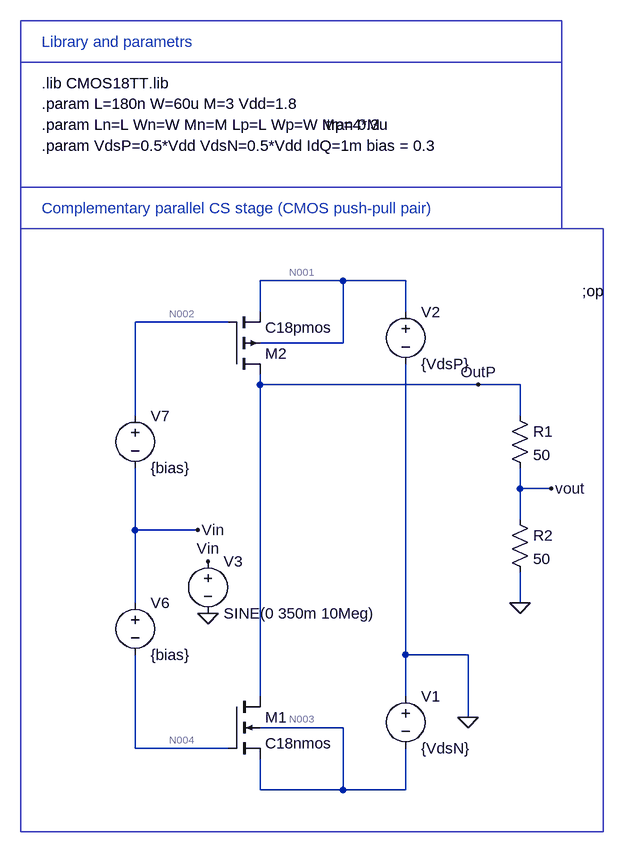
[diagram p0: schematic CompParallel.asc]
CompParallel.asc, the LTspice schematic file:
Version 4
SHEET 1 1812 980
WIRE 864 16 736 16
WIRE 960 16 864 16
WIRE 736 64 736 16
WIRE 960 64 960 16
WIRE 688 80 544 80
WIRE 864 112 864 16
WIRE 864 112 736 112
WIRE 736 176 736 160
WIRE 1072 176 736 176
WIRE 1136 176 1072 176
WIRE 544 224 544 80
WIRE 1136 224 1136 176
WIRE 1136 336 1136 304
WIRE 1184 336 1136 336
WIRE 1136 384 1136 336
WIRE 544 400 544 304
WIRE 640 400 544 400
WIRE 544 512 544 400
WIRE 1136 512 1136 464
WIRE 960 592 960 144
WIRE 1056 592 960 592
WIRE 736 656 736 176
WIRE 960 656 960 592
WIRE 1056 688 1056 592
WIRE 864 704 736 704
WIRE 544 736 544 592
WIRE 688 736 544 736
WIRE 736 800 736 752
WIRE 864 800 864 704
WIRE 864 800 736 800
WIRE 960 800 960 736
WIRE 960 800 864 800
FLAG 1072 176 OutP
FLAG 1056 688 0
FLAG 656 528 0
FLAG 656 448 Vin
FLAG 640 400 Vin
FLAG 1136 512 0
FLAG 1184 336 vout
DATAFLAG 640 80 ""
DATAFLAG 640 736 ""
SYMBOL nmos4 688 656 R0
SYMATTR InstName M1
SYMATTR Value C18nmos
SYMATTR Value2 l={Ln} w={Wn} m={Mn}
SYMBOL pmos4 688 160 M180
SYMATTR InstName M2
SYMATTR Value2 l={Lp} w={Wp} m={Mp}
SYMATTR Value C18pmos
SYMBOL voltage 960 640 R0
SYMATTR InstName V1
SYMATTR Value {VdsN}
SYMBOL voltage 960 48 R0
WINDOW 123 0 0 Left 0
WINDOW 39 0 0 Left 0
SYMATTR InstName V2
SYMATTR Value {VdsP}
SYMBOL voltage 656 432 R0
WINDOW 123 0 0 Left 0
WINDOW 39 0 0 Left 0
SYMATTR InstName V3
SYMATTR Value SINE(0 350m 10Meg)
SYMBOL voltage 544 496 R0
SYMATTR InstName V6
SYMATTR Value {bias}
SYMBOL voltage 544 208 R0
WINDOW 123 0 0 Left 0
WINDOW 39 0 0 Left 0
SYMATTR InstName V7
SYMATTR Value {bias}
SYMBOL res 1120 208 R0
SYMATTR InstName R1
SYMATTR Value 50
SYMBOL res 1120 368 R0
SYMATTR InstName R2
SYMATTR Value 50
TEXT 400 -256 Left 2 !.param L=180n W=60u M=3 Vdd=1.8
TEXT 400 -192 Left 2 !.param VdsP=0.5*Vdd VdsN=0.5*Vdd IdQ=1m bias = 0.3
TEXT 400 -224 Left 2 !.param Ln=L Wn=W Mn=M Lp=L Wp=W Mp=4*M
TEXT 400 -288 Left 2 !.lib CMOS18TT.lib
TEXT 400 -96 Left 2 ;Complementary parallel CS stage (CMOS push-pull pair)
TEXT 400 -352 Left 2 ;Library and parametrs
TEXT 1232 32 Left 2 !;op
TEXT 832 -224 Left 2 !.tran 0.3u
RECTANGLE Normal 1264 864 368 -64
RECTANGLE Normal 1200 -320 368 -384
RECTANGLE Normal 1200 -64 368 -128
RECTANGLE Normal 1200 -128 368 -320

The netlist it stands for:
* CompParallel.asc
M1 OutP N004 N003 N003 C18nmos l={Ln} w={Wn} m={Mn}
M2 OutP N002 N001 N001 C18pmos l={Lp} w={Wp} m={Mp}
V1 0 N003 {VdsN}
V2 N001 0 {VdsP}
V3 Vin 0 SINE(0 350m 10Meg)
V6 Vin N004 {bias}
V7 N002 Vin {bias}
R1 OutP vout 50
R2 vout 0 50
.model NMOS NMOS
.model PMOS PMOS
.lib standard.mos
.param L=180n W=60u M=3 Vdd=1.8
.param VdsP=0.5*Vdd VdsN=0.5*Vdd IdQ=1m bias = 0.3
.param Ln=L Wn=W Mn=M Lp=L Wp=W Mp=4*M
.lib CMOS18TT.lib
* Complementary parallel CS stage (CMOS push-pull pair)
* Library and parametrs
;op
.tran 0.3u
.backanno
.end

* Results of the author's LTspice run, read from the files saved beside the schematic
* Operating Point, zero values left out:
*   V(outp) = -14.79 mV
*   V(n004) = -300 mV
*   V(n003) = -900 mV
*   V(n002) = 300 mV
*   V(n001) = 900 mV
*   V(vout) = -7.397 mV
*   Id(M2) = -2.324 mA
*   Ib(M2) = 11.1 pA
*   Is(M2) = 2.324 mA
*   Id(M1) = 2.472 mA
*   Ib(M1) = -2.686 pA
*   Is(M1) = -2.472 mA
*   I(R2) = -147.9 µA
*   I(R1) = -147.9 µA
*   I(V2) = -2.324 mA
*   I(V1) = -2.472 mA
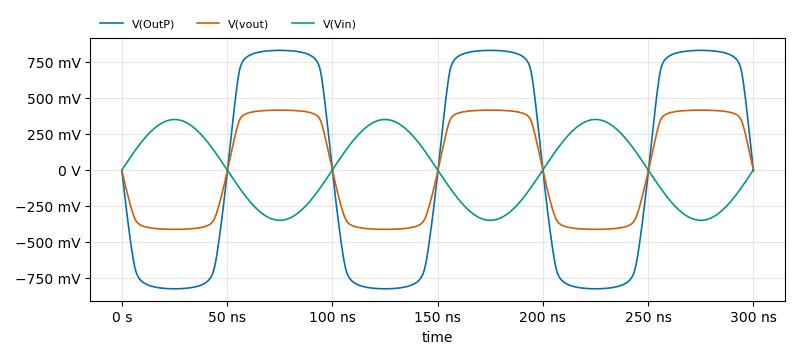
[diagram p1: Transient Analysis of CompParallel.asc, plotted from the saved traces]
* Transient Analysis, 1 run:
*   V(OutP): min -825.4 mV, max 829.9 mV, average 3.603 mV, rms 730.8 mV, last -5.645 mV
*   V(vout): min -412.7 mV, max 414.9 mV, average 1.802 mV, rms 365.4 mV, last -2.823 mV
*   V(Vin): min -350 mV, max 350 mV, average 299.2 nV, rms 247.5 mV, last 0 V